# Altium schematic sheet InterleavedBoost.SchDoc
size A4
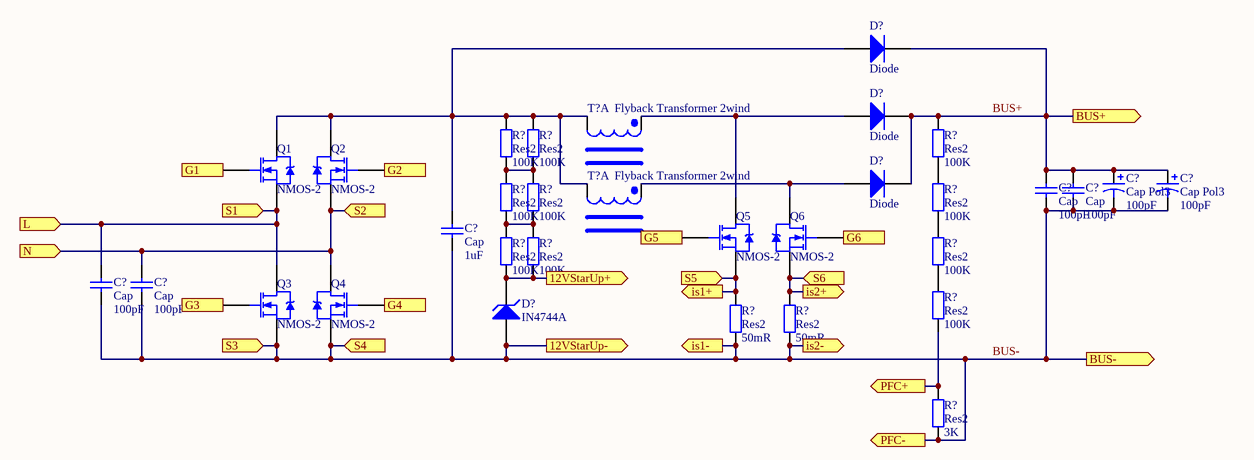
[diagram p0: InterleavedBoost.SchDoc]

## Parts
(Parts that share a designator on the sheet are numbered #1, #2 ... from top to bottom, then left to right.)
C?#1  Cap Pol3  value 100pF  [C0805]
C?#2  Cap Pol3  value 100pF  [C0805]
C?#3  Cap  value 100pF  [RAD-0.3]
C?#4  Cap  value 100pF  [RAD-0.3]
C?#5  Cap  value 1uF  [RAD-0.3]
C?#6  Cap  value 100pF  [RAD-0.3]
C?#7  Cap  value 100pF  [RAD-0.3]
D?#1  Diode  [SMC]
D?#2  Diode  [SMC]
D?#3  Diode  [SMC]
D?#4  IN4744A  [DIODE-0.7]
Q1  NMOS-2  [TO-220AB]
Q2  NMOS-2  [TO-220AB]
Q3  NMOS-2  [TO-220AB]
Q4  NMOS-2  [TO-220AB]
Q5  NMOS-2  [TO-220AB]
Q6  NMOS-2  [TO-220AB]
R?#1  Res2  value 100K  [AXIAL-0.4]
R?#2  Res2  value 100K  [AXIAL-0.4]
R?#3  Res2  value 100K  [AXIAL-0.4]
R?#4  Res2  value 100K  [AXIAL-0.4]
R?#5  Res2  value 100K  [AXIAL-0.4]
R?#6  Res2  value 100K  [AXIAL-0.4]
R?#7  Res2  value 100K  [AXIAL-0.4]
R?#8  Res2  value 100K  [AXIAL-0.4]
R?#9  Res2  value 100K  [AXIAL-0.4]
R?#10  Res2  value 100K  [AXIAL-0.4]
R?#11  Res2  value 50mR  [AXIAL-0.4]
R?#12  Res2  value 50mR  [AXIAL-0.4]
R?#13  Res2  value 3K  [AXIAL-0.4]
T?#1  Flyback Transformer 2wind  (part A of 2)
T?#2  Flyback Transformer 2wind  (part A of 2)

## Ports
12VStarUp+ (out), 12VStarUp- (out), BUS+ (out), BUS- (out), G1 (in), G2 (in), G3 (in), G4 (in), G5 (in), G6 (in), is1+ (out), is1- (out), is2+ (out), is2- (out), L (in), N (in), PFC+ (out), PFC- (out), S1 (in), S2 (in), S3 (in), S4 (in), S5 (in), S6 (in)

## Nets
12VStarUp+: D?#4.2(K) R?#7.1 R?#8.1 ; port 12VStarUp+
BUS+: C?#1.1 C?#2.1 C?#3.2 C?#4.2 D?#1.2(K) D?#2.2(K) D?#3.2(K) R?#3.2 ; port BUS+
BUS-: C?#1.2 C?#2.2 C?#3.1 C?#4.1 C?#5.1 C?#6.1 C?#7.1 D?#4.1(A) Q3.3(S) Q4.3(S) R?#11.1 R?#12.1 R?#13.1 ; port BUS-, port 12VStarUp-, port S3, port S4, port is2-, port is1-, port PFC-
G1: Q1.1(G) ; port G1
G2: Q2.1(G) ; port G2
G3: Q3.1(G) ; port G3
G4: Q4.1(G) ; port G4
G5: Q5.1(G) ; port G5
G6: Q6.1(G) ; port G6
is1+: Q5.3(S) R?#11.2 ; port S5, port is1+
is2+: Q6.3(S) R?#12.2 ; port S6, port is2+
L: C?#6.2 Q1.3(S) Q3.2(D) ; port L, port S1
N: C?#7.2 Q2.3(S) Q4.2(D) ; port N, port S2
PFC+: R?#10.1 R?#13.2 ; port PFC+
NetC?#5_2: C?#5.2 D?#1.1(A) Q1.2(D) Q2.2(D) R?#1.2 R?#2.2 T?#1.2 T?#2.2
NetD?#2_1: D?#2.1(A) Q5.2(D) T?#1.1
NetD?#3_1: D?#3.1(A) Q6.2(D) T?#2.1
NetR?#1_1: R?#1.1 R?#2.1 R?#4.2 R?#5.2
NetR?#3_1: R?#3.1 R?#6.2
NetR?#4_1: R?#4.1 R?#5.1 R?#7.2 R?#8.2
NetR?#6_1: R?#6.1 R?#9.2
NetR?#9_1: R?#9.1 R?#10.2

## Notes on the sheet
- Title
- Size:
- Date:
- A4
- Number:
- Time:
- Revision:
- Sheet
- of
- File:

## Library data of the parts
C?#1 C?#2 = Cap Pol3: Polarized Capacitor (Surface Mount); Published: 8-Jun-2000; LatestRevisionDate: 29-May-2009; LatestRevisionNote: IPC-7351 Footprint Added.; PackageReference: C0805; Publisher: Altium Limited; PackageDescription: Chip Capacitor
C?#3-C?#7 = Cap: Capacitor; Published: 8-Jun-2000; LatestRevisionDate: 17-Jul-2002; LatestRevisionNote: Re-released for DXP Platform.; PackageReference: RAD-0.3; Publisher: Altium Limited; PackageDescription: Radial Cap, Thru-Hole; 2 Leads; 0.3 in Pin Spacing
D?#1-D?#3 = Diode: Default Diode; Published: 8-Jun-2000; LatestRevisionDate: 17-Jul-2002; LatestRevisionNote: Re-released for DXP Platform.; PackageVersion: Sep-1996; PackageReference: SMC; Publisher: Altium Limited; PackageDescription: DO-214-AB/SMC; 2 C-Bend Leads; Body 7.9 x 5.9 mm, inc. leads (LxW); Code_JEDEC: DO-214-AB
D?#4 = D Zener: Zener Diode; Published: 8-Jun-2000; LatestRevisionDate: 17-Jul-2002; LatestRevisionNote: Re-released for DXP Platform.; PackageReference: DIODE-0.7; Publisher: Altium Limited; PackageDescription: Diode, Thru-Hole; 2 Leads; 0.7 in Pin Spacing
Q1-Q6 = NMOS-2: N-Channel Power MOSFET; Note: Pin 2 is electrically connected to pin 4.; Published: 8-Jun-2000; LatestRevisionDate: 17-Jul-2002; LatestRevisionNote: Re-released for DXP Platform.; DatasheetVersion: PD-9.814; PackageVersion: Feb-1997; PackageReference: TO-220AB; Publisher: Altium Limited; PackageDescription: TO, Thru-Hole, Vertical, Heatsink Mounted; 3 In-Line Leads; Pitch 2.54 mm; ComponentLink1Description: Manufacturer Link; ComponentLink1URL: http://www.irf.com/
R?#1-R?#13 = Res2: Resistor; Published: 8-Jun-2000; LatestRevisionDate: 17-Jul-2002; LatestRevisionNote: Re-released for DXP Platform.; PackageReference: AXIAL-0.4; Publisher: Altium Limited; PackageDescription: Axial Device, Thru-Hole; 2 Leads; 0.4 in Pin Spacing